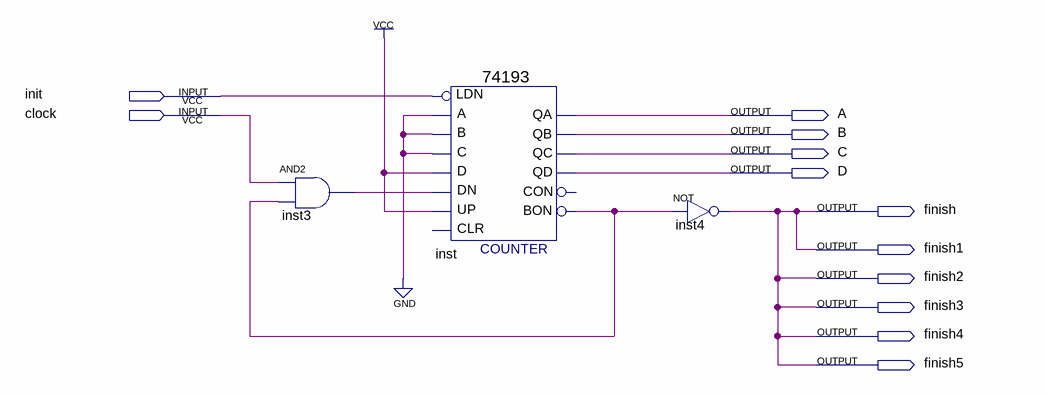
[diagram p0: schematic sheet]
// Quartus schematic startmod.bdf as structural Verilog: 3 symbols, 12 pins
module startmod (
  input  init,
  input  clock,
  output A,
  output B,
  output C,
  output D,
  output finish,
  output finish1,
  output finish2,
  output finish3,
  output finish4,
  output finish5
);

  wire inst3_out, inst_bon;

  and inst3 (inst3_out, clock, inst_bon);
  \74193  inst (
    .D(1'b1), .C(1'b0), .B(1'b0), .A(1'b0), .UP(1'b1), .DN(inst3_out), .LDN(init), .QB(B), .QA(A), .QD(D),
    .QC(C), .BON(inst_bon));  // open: CLR, CON
  not inst4 (finish, inst_bon);

  assign finish1 = finish;
  assign finish2 = finish;
  assign finish3 = finish;
  assign finish4 = finish;
  assign finish5 = finish;
endmodule
